# Altium project SCB.PrjPCB (part 8 of 8)

## Sheet CPU_EBI1_FPGA_Memory.SchDoc: CPU_EBI1_FPGA_Memory
size A3; Date: 18/06/2014; DrawnBy: J. Gabriel R.E.; Organization: Seven Solutions S.L.; Address1: C/Baza, Parcela 19, Nave 3; Address2: Polígono Ind. Juncaril; Address3: 18210-Peligros-Granada; Address4: Spain; Revision: 3.4; SheetNumber: 5; SheetTotal: 23; WebAddress: www.sevensols.com; Project: White Rabbit; ProjectName: Project Name
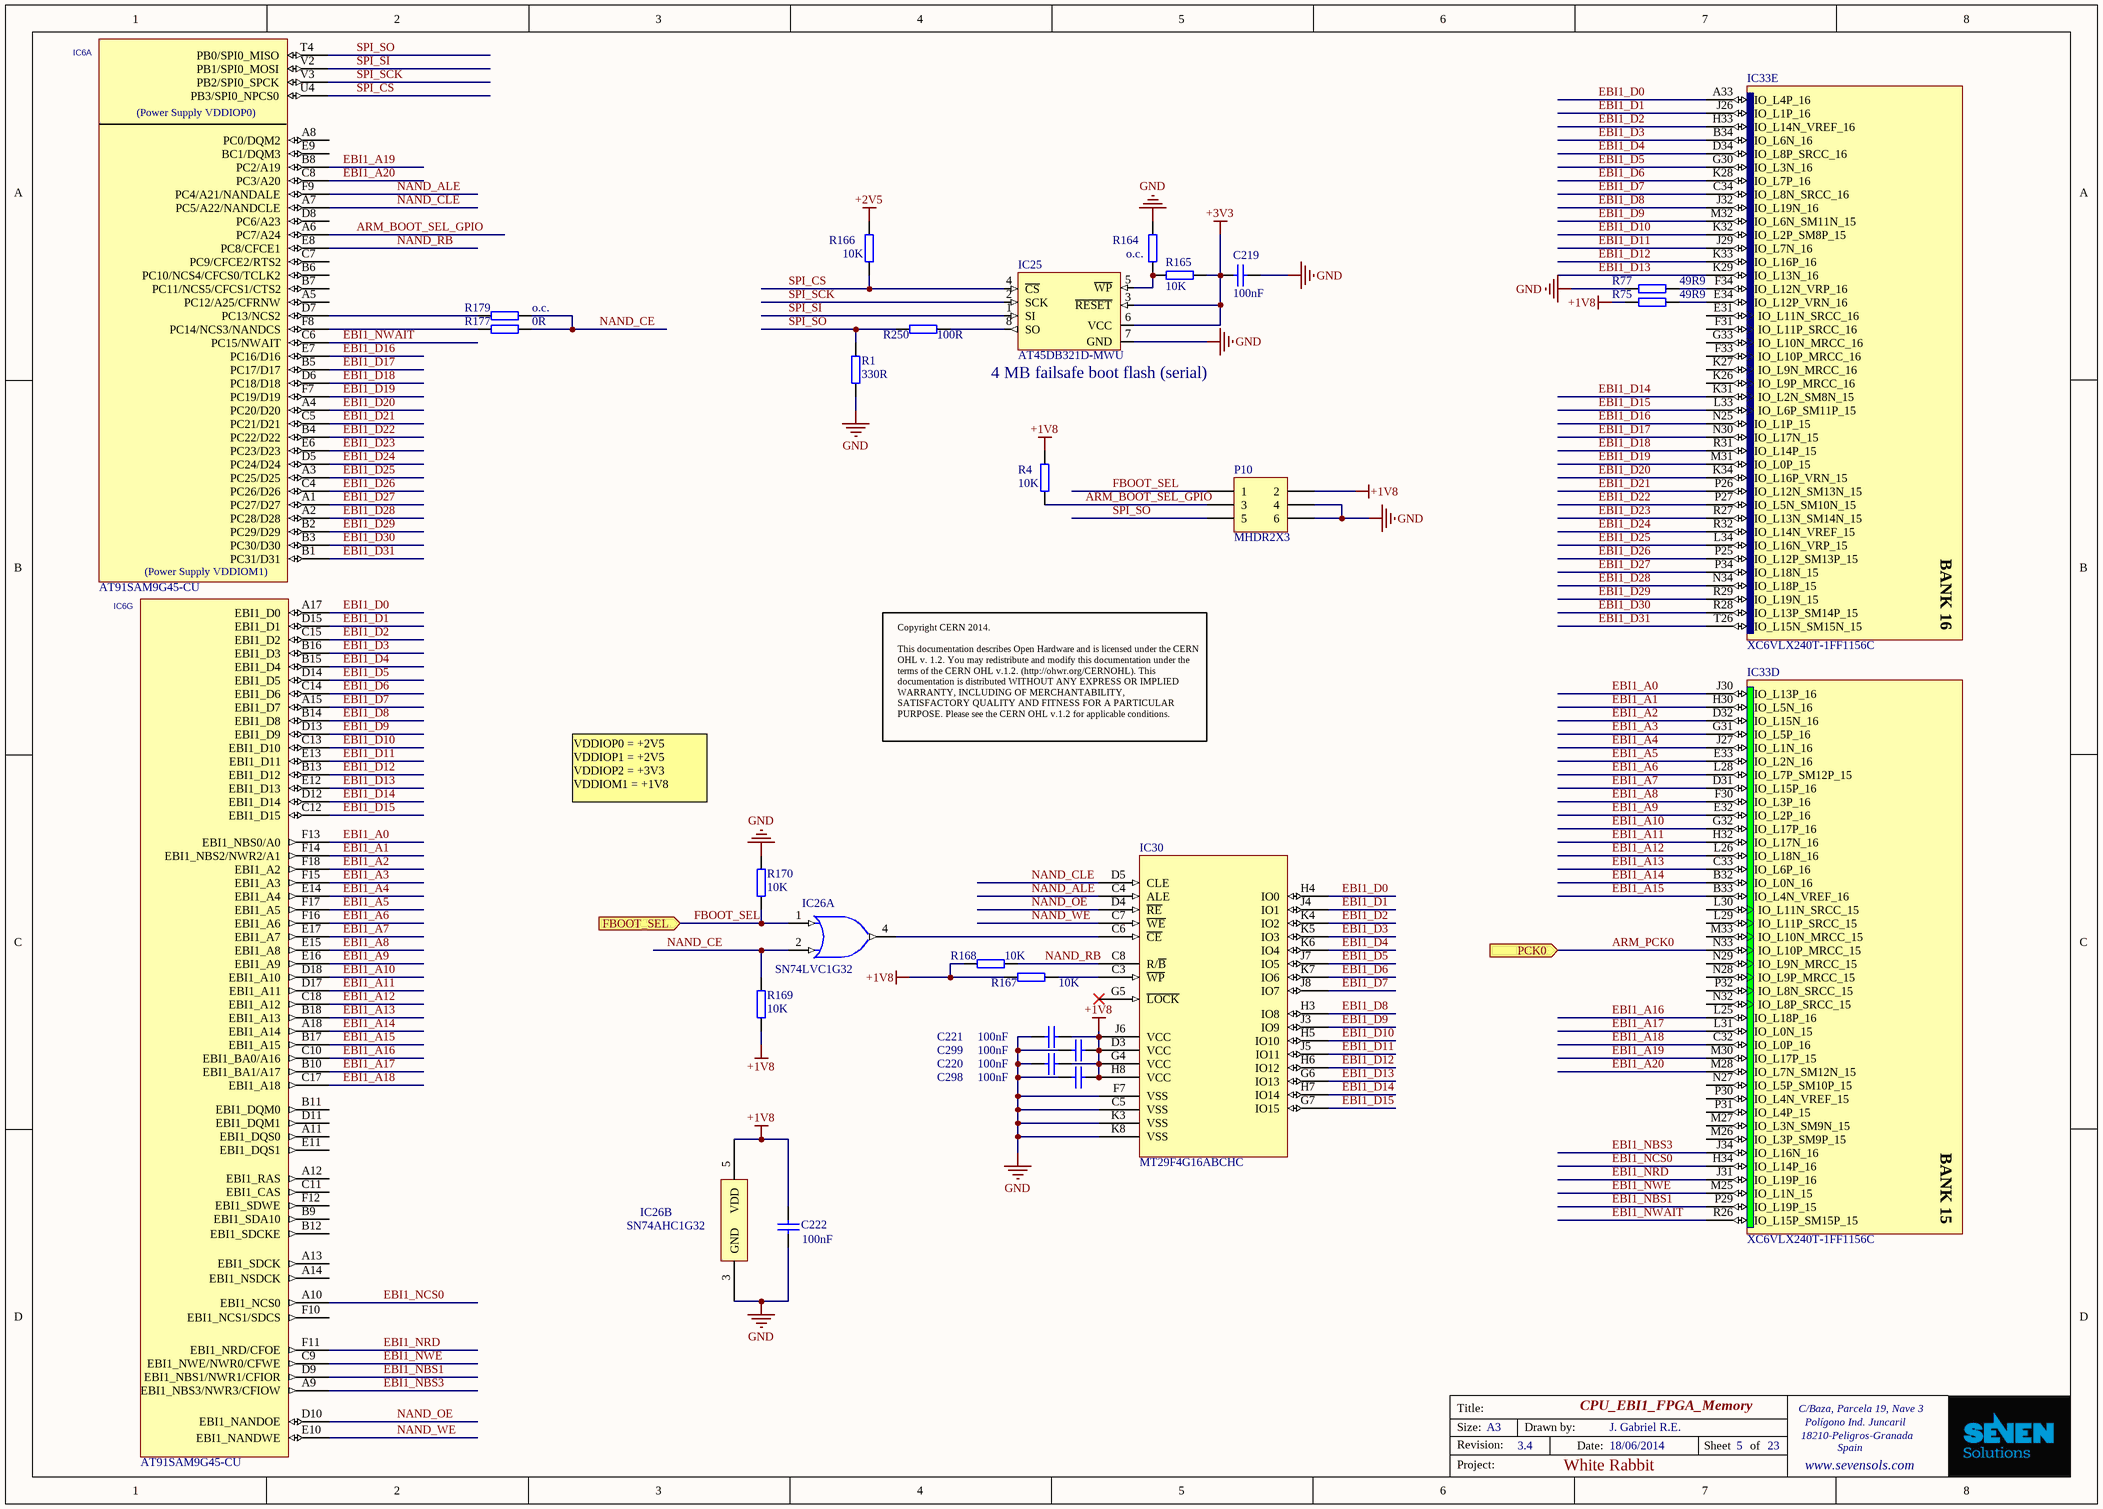
[diagram p22: CPU_EBI1_FPGA_Memory.SchDoc]

### Parts
C219  100nF  [CC1005-0402]
C220  100nF  [CC1005-0402]
C221  100nF  [CC1005-0402]
C222  100nF  [CC1005-0402]
C298  100nF  [CC1005-0402]
C299  100nF  [CC1005-0402]
IC6  AT91SAM9G45-CU  [TFBGA324]  (parts A,G of 12)
IC25  AT45DB321D-MWU  [8MW_8CN3_Merge]
IC26  SN74LVC1G32  [SOT23-5AL]  (parts A,B of 2)
IC30  MT29F4G16ABCHC  [VFBGA63]
IC33  XC6VLX240T-1FF1156C  [FF1156]  (parts D,E of 20)
P10  MHDR2X3  [MHDR2X3_1.27mm]
R1  330R  [0402]
R4  10K  [0402]
R75  49R9  [0402]
R77  49R9  [0402]
R164  o.c.  [0402]
R165  10K  [0402]
R166  10K  [0402]
R167  10K  [0402]
R168  10K  [0402]
R169  10K  [0402]
R170  10K  [0402]
R177  0R  [0603]
R179  o.c.  [0402]
R250  100R  [0402]

### Ports
FBOOT_SEL (in), PCK0 (in)

### Nets
+1V8: C220.1 C221.1 C222.2 C298.1 C299.1 IC26.5(VDD) IC30.D3(VCC) IC30.G4(VCC) IC30.H8(VCC) IC30.J6(VCC) P10.2 R4.2 R75.2 R167.2 R168.2 R169.2
+2V5: R166.2
+3V3: C219.1 IC25.3(~{RESET}) IC25.6(VCC) R165.2
GND: C219.2 C220.2 C221.2 C222.1 C298.2 C299.2 IC25.7(GND) IC26.3(GND) IC30.C5(VSS) IC30.F7(VSS) IC30.K3(VSS) IC30.K8(VSS) P10.4 P10.6 R1.1 R77.2 R164.1 R170.2
ARM_BOOT_SEL_GPIO: IC6.A6(PC7/A24) P10.3 R4.1
ARM_PCK0: IC33.N33(IO_L10P_MRCC_15) ; port PCK0
EBI1_A0: IC6.F13(EBI1_NBS0/A0) IC33.J30(IO_L13P_16)
EBI1_A1: IC6.F14(EBI1_NBS2/NWR2/A1) IC33.H30(IO_L5N_16)
EBI1_A2: IC6.F18(EBI1_A2) IC33.D32(IO_L15N_16)
EBI1_A3: IC6.F15(EBI1_A3) IC33.G31(IO_L5P_16)
EBI1_A4: IC6.E14(EBI1_A4) IC33.J27(IO_L1N_16)
EBI1_A5: IC6.F17(EBI1_A5) IC33.E33(IO_L2N_16)
EBI1_A6: IC6.F16(EBI1_A6) IC33.L28(IO_L7P_SM12P_15)
EBI1_A7: IC6.E17(EBI1_A7) IC33.D31(IO_L15P_16)
EBI1_A8: IC6.E15(EBI1_A8) IC33.F30(IO_L3P_16)
EBI1_A9: IC6.E16(EBI1_A9) IC33.E32(IO_L2P_16)
EBI1_A10: IC6.D18(EBI1_A10) IC33.G32(IO_L17P_16)
EBI1_A11: IC6.D17(EBI1_A11) IC33.H32(IO_L17N_16)
EBI1_A12: IC6.C18(EBI1_A12) IC33.L26(IO_L18N_16)
EBI1_A13: IC6.B18(EBI1_A13) IC33.C33(IO_L6P_16)
EBI1_A14: IC6.A18(EBI1_A14) IC33.B32(IO_L0N_16)
EBI1_A15: IC6.B17(EBI1_A15) IC33.B33(IO_L4N_VREF_16)
EBI1_A16: IC6.C10(EBI1_BA0/A16) IC33.L25(IO_L18P_16)
EBI1_A17: IC6.B10(EBI1_BA1/A17) IC33.L31(IO_L0N_15)
EBI1_A18: IC6.C17(EBI1_A18) IC33.C32(IO_L0P_16)
EBI1_A19: IC6.B8(PC2/A19) IC33.M30(IO_L17P_15)
EBI1_A20: IC6.C8(PC3/A20) IC33.M28(IO_L7N_SM12N_15)
EBI1_D0: IC6.A17(EBI1_D0) IC30.H4(IO0) IC33.A33(IO_L4P_16)
EBI1_D1: IC6.D15(EBI1_D1) IC30.J4(IO1) IC33.J26(IO_L1P_16)
EBI1_D2: IC6.C15(EBI1_D2) IC30.K4(IO2) IC33.H33(IO_L14N_VREF_16)
EBI1_D3: IC6.B16(EBI1_D3) IC30.K5(IO3) IC33.B34(IO_L6N_16)
EBI1_D4: IC6.B15(EBI1_D4) IC30.K6(IO4) IC33.D34(IO_L8P_SRCC_16)
EBI1_D5: IC6.D14(EBI1_D5) IC30.J7(IO5) IC33.G30(IO_L3N_16)
EBI1_D6: IC6.C14(EBI1_D6) IC30.K7(IO6) IC33.K28(IO_L7P_16)
EBI1_D7: IC6.A15(EBI1_D7) IC30.J8(IO7) IC33.C34(IO_L8N_SRCC_16)
EBI1_D8: IC6.B14(EBI1_D8) IC30.H3(IO8) IC33.J32(IO_L19N_16)
EBI1_D9: IC6.D13(EBI1_D9) IC30.J3(IO9) IC33.M32(IO_L6N_SM11N_15)
EBI1_D10: IC6.C13(EBI1_D10) IC30.H5(IO10) IC33.K32(IO_L2P_SM8P_15)
EBI1_D11: IC6.E13(EBI1_D11) IC30.J5(IO11) IC33.J29(IO_L7N_16)
EBI1_D12: IC6.B13(EBI1_D12) IC30.H6(IO12) IC33.K33(IO_L16P_16)
EBI1_D13: IC6.E12(EBI1_D13) IC30.G6(IO13) IC33.K29(IO_L13N_16)
EBI1_D14: IC6.D12(EBI1_D14) IC30.H7(IO14) IC33.K31(IO_L2N_SM8N_15)
EBI1_D15: IC6.C12(EBI1_D15) IC30.G7(IO15) IC33.L33(IO_L6P_SM11P_15)
EBI1_D16: IC6.E7(PC16/D16) IC33.N25(IO_L1P_15)
EBI1_D17: IC6.B5(PC17/D17) IC33.N30(IO_L17N_15)
EBI1_D18: IC6.D6(PC18/D18) IC33.R31(IO_L14P_15)
EBI1_D19: IC6.F7(PC19/D19) IC33.M31(IO_L0P_15)
EBI1_D20: IC6.A4(PC20/D20) IC33.K34(IO_L16P_VRN_15)
EBI1_D21: IC6.C5(PC21/D21) IC33.P26(IO_L12N_SM13N_15)
EBI1_D22: IC6.B4(PC22/D22) IC33.P27(IO_L5N_SM10N_15)
EBI1_D23: IC6.E6(PC23/D23) IC33.R27(IO_L13N_SM14N_15)
EBI1_D24: IC6.D5(PC24/D24) IC33.R32(IO_L14N_VREF_15)
EBI1_D25: IC6.A3(PC25/D25) IC33.L34(IO_L16N_VRP_15)
EBI1_D26: IC6.C4(PC26/D26) IC33.P25(IO_L12P_SM13P_15)
EBI1_D27: IC6.A1(PC27/D27) IC33.P34(IO_L18N_15)
EBI1_D28: IC6.A2(PC28/D28) IC33.N34(IO_L18P_15)
EBI1_D29: IC6.B2(PC29/D29) IC33.R29(IO_L19N_15)
EBI1_D30: IC6.B3(PC30/D30) IC33.R28(IO_L13P_SM14P_15)
EBI1_D31: IC6.B1(PC31/D31) IC33.T26(IO_L15N_SM15N_15)
EBI1_NBS1: IC6.D9(EBI1_NBS1/NWR1/CFIOR) IC33.P29(IO_L19P_15)
EBI1_NBS3: IC6.A9(EBI1_NBS3/NWR3/CFIOW) IC33.J34(IO_L16N_16)
EBI1_NCS0: IC6.A10(EBI1_NCS0) IC33.H34(IO_L14P_16)
EBI1_NRD: IC6.F11(EBI1_NRD/CFOE) IC33.J31(IO_L19P_16)
EBI1_NWAIT: IC6.C6(PC15/NWAIT) IC33.R26(IO_L15P_SM15P_15)
EBI1_NWE: IC6.C9(EBI1_NWE/NWR0/CFWE) IC33.M25(IO_L1N_15)
FBOOT_SEL: IC26.1(A) P10.1 R170.1 ; port FBOOT_SEL
NAND_ALE: IC6.F9(PC4/A21/NANDALE) IC30.C4(ALE)
NAND_CE: IC26.2(B) R169.1 R177.1 R179.1
NAND_CLE: IC6.A7(PC5/A22/NANDCLE) IC30.D5(CLE)
NAND_OE: IC6.D10(EBI1_NANDOE) IC30.D4(~{RE})
NAND_RB: IC6.E8(PC8/CFCE1) IC30.C8(R/~{B}) R168.1
NAND_WE: IC6.E10(EBI1_NANDWE) IC30.C7(~{WE})
SPI_CS: IC6.U4(PB3/SPI0_NPCS0) IC25.4(~{CS}) R166.1
SPI_SCK: IC6.V3(PB2/SPI0_SPCK) IC25.2(SCK)
SPI_SI: IC6.V2(PB1/SPI0_MOSI) IC25.1(SI)
SPI_SO: IC6.T4(PB0/SPI0_MISO) P10.5 R1.2 R250.2
NetIC6_D7: IC6.D7(PC13/NCS2) R179.2
NetIC6_F8: IC6.F8(PC14/NCS3/NANDCS) R177.2
NetIC25_5: IC25.5(~{WP}) R164.2 R165.1
NetIC25_8: IC25.8(SO) R250.1
NetIC26_4: IC26.4(Y) IC30.C6(~{CE})
NetIC30_C3: IC30.C3(~{WP}) R167.1
NetIC33_E34: IC33.E34(IO_L12P_VRN_16) R75.1
NetIC33_F34: IC33.F34(IO_L12N_VRP_16) R77.1

Not connected (* = marked no-connect by the designer): IC6 A5(PC12/A25/CFRNW) A8(PC0/DQM2) A11(EBI1_DQS0) A12(EBI1_RAS) A13(EBI1_SDCK) A14(EBI1_NSDCK) B6(PC10/NCS4/CFCS0/TCLK2) B7(PC11/NCS5/CFCS1/CTS2) B9(EBI1_SDA10) B11(EBI1_DQM0) B12(EBI1_SDCKE) C7(PC9/CFCE2/RTS2) C11(EBI1_CAS) D8(PC6/A23) D11(EBI1_DQM1) E9(BC1/DQM3) E11(EBI1_DQS1) F10(EBI1_NCS1/SDCS) F12(EBI1_SDWE); IC30 G5(~{LOCK})*; IC33 E31(IO_L11N_SRCC_16) F31(IO_L11P_SRCC_16) F33(IO_L10P_MRCC_16) G33(IO_L10N_MRCC_16) K26(IO_L9P_MRCC_16) K27(IO_L9N_MRCC_16) L29(IO_L11P_SRCC_15) L30(IO_L11N_SRCC_15) M26(IO_L3P_SM9P_15) M27(IO_L3N_SM9N_15) M33(IO_L10N_MRCC_15) N27(IO_L5P_SM10P_15) N28(IO_L9P_MRCC_15) N29(IO_L9N_MRCC_15) N32(IO_L8P_SRCC_15) P30(IO_L4N_VREF_15) P31(IO_L4P_15) P32(IO_L8N_SRCC_15)

### Notes on the sheet
- (near IC25) 4 MB failsafe boot flash (serial)
- Copyright CERN 2014.
  This documentation describes Open Hardware and is licensed under the CERN OHL v. 1.2. You may redistribute and modify this documentation under the terms of the CERN OHL v.1.2. (http://ohwr.org/CERNOHL). This documentation is distributed WITHOUT ANY EXPRESS OR IMPLIED WARRANTY, INCLUDING OF MERCHANTABILITY, SATISFACTORY QUALITY AND FITNESS FOR A PARTICULAR PURPOSE. Please see the CERN OHL v.1.2 for applicable conditions.
- VDDIOP0 = +2V5
  VDDIOP1 = +2V5
  VDDIOP2 = +3V3
  VDDIOM1 = +1V8
- Title:
- Size:
- Revision:
- A3
- Drawn by:
- Date:
- Sheet
- of
- Project:
- (in symbol AT91SAM9G45-CU, part A) (Power Supply VDDIOP0); (Power Supply VDDIOM1)
- (in symbol XC6VLX130T-1FF1156C, part D) BANK 15
- (in symbol XC6VLX130T-1FF1156C, part E) BANK 16

### Library data of the parts
C219-C222 C298 C299 = CC0402_100NF_16V_10%_X7R: Capacitor; Manufacturer1: TDK; Manufacturer1 PN: C1005X7R1C104K; TC: X7R; Tolerance: ±10%; Voltage: 16V; Published: 8-Jun-2000; LatestRevisionDate: 17-Jul-2002; LatestRevisionNote: Re-released for DXP Platform.; PackageReference: RAD-0.3; Publisher: Altium Limited; Distributor1: Digikey; Distributor1 PN: 445-4952-1-ND; Case: 0402; Value: 100nF
IC6 = AT91SAM9G45-CU: Atmel 400MHz ARM926 MCU; Value: AT91SAM9G45-CU; Distributor1 PN: AT91SAM9G45-CU-ND; Distributor1: Digikey
IC25 = AT45DB642D: 64-megabit 2.7V, Dual-Interface DataFlash; Value: AT45DB321D-MWU; Distributor1 PN: 556-AT45DB321D-MWU; Case: VDFN; Distributor1: Mouser
IC26 = SN74AHC1G32: TI single OR gate; RefId: 296-9847-1-ND; Value: SN74LVC1G32DBVR; Supplier: Digikey
IC30 = MT29F4G16ABCHC: NAND Flash 256Mx16, 1.8V Asynch/Page; Value: MT29F4G16ABCHC:C TR; Distributor1: Digikey; Distributor1 PN: 557-1369-1-ND
IC33 = XC6VLX130T-1FF1156C: Virtex-6 LXT Platform FPGA, 600 User I/Os, 20 GTXs, 1156-Ball FFBGA, Speed Grade 1, Commercial Grade; FirstPublished: 17-Nov-2009; DatasheetVersion: v2.0, Sep-2009; PackageVersion: ver1.0, Jun-2009; PackageReference: FF1156; Publisher: Altium Limited; PackageDescription: 1156-Ball Flip-Chip Fine Pitch Ball Grid Array (FF1156); Code_JEDEC: MS-034-AAR-1; Code_IPC: BGA100P34X34-1156; ComponentLink1Description: Virtex-6 Datasheet; ComponentLink1URL: http://www.xilinx.com/support/documentation/data_sheets/ds150.pdf; ComponentLink2Description: Pinout Specification; ComponentLink2URL: http://www.xilinx.com/support/packagefiles/virtex-6-pkgs.htm; ComponentLink3Description: FF1156 Package Drawing; ComponentLink3URL: http://www.xilinx.com/support/documentation/package_specs/ff1156.pdf; ComponentLink4Description: Virtex-6 Documents; ComponentLink4URL: http://www.xilinx.com/support/documentation/virtex-6.htm; ComponentLink5Description: Xilinx.com Home; ComponentLink5URL: http://www.xilinx.com
P10 = MHDR2X3: SMD Header, 3-Pin, Dual row, 2.54mm pitch; Manufacturer1 PN: GRPB032VWVN-RC; Manufacturer1: Sullins; Distributor1: Digikey; Distributor1 PN: S9015E-03-ND
R1 = R0402_330R_±1%_0.1W_100PPM: SMD Resistor; Manufacturer1: Panasonic; Manufacturer1 PN: ERJ-2RKF3300X; TCR: 100ppm; Power Rating: 0.1W; Tolerance: ±1%; Case: 0402; Distributor1: DigiKey; Distributor1 PN: P330LCT-ND; Value: 330R
R4 R165-R170 = R0402_10K_±1%_0.1W_100PPM: SMD Resistor; Manufacturer1: Panasonic; Manufacturer1 PN: ERJ-2RKF1002X; TCR: 100ppm; Power Rating: 0.1W; Tolerance: ±1%; Case: 0402; Distributor1: DigiKey; Distributor1 PN: P10.0KLCT-ND; Value: 10K
R75 R77 = R0402_49R9_±1%_0.1W_100PPM: SMD Resistor; Manufacturer1: Panasonic; Manufacturer1 PN: ERJ-2RKF49R9X; TCR: 100ppm; Power Rating: 0.1W; Tolerance: ±1%; Case: 0402; Distributor1: DigiKey; Distributor1 PN: P49.9LCT-ND; Value: 49R9
R164 R179 = R0402_O.C.: SMD Resistor; Mounted: No; Case: 0402; Manufacturer1: N/A; Manufacturer1 PN: N/A; Distributor1: N/A; Distributor1 PN: N/A; TCR: N/A; Power Rating: N/A; Tolerance: N/A; Value: o.c.
R177 = R0603_0R_0.1W_JUMPER: SMD Resistor; Manufacturer1: Yageo; Manufacturer1 PN: RC0603JR-070RL; TCR: 200ppm; Power Rating: 0.1W; Case: 0603; Distributor1: DigiKey; Distributor1 PN: 311-0.0GRCT-ND; Tolerance: -; Value: 0R
R250 = R0402_100R_±1%_0.1W_100PPM: SMD Resistor; Manufacturer1: Panasonic; Manufacturer1 PN: ERJ-2RKF1000X; TCR: 100ppm; Power Rating: 0.1W; Tolerance: ±1%; Case: 0402; Distributor1: DigiKey; Distributor1 PN: P100LCT-ND; Value: 100R

## Sheet CPU_DDR2.SchDoc: CPU_DDR2
size A4; Date: 18/06/2014; DrawnBy: J. Gabriel R.E.; Organization: Seven Solutions S.L.; Address1: C/Baza, Parcela 19, Nave 3; Address2: Polígono Ind. Juncaril; Address3: 18210-Peligros-Granada; Address4: Spain; Revision: 3.4; SheetNumber: 23; SheetTotal: 23; WebAddress: www.sevensols.com; Project: White Rabbit; ProjectName: White Rabbit
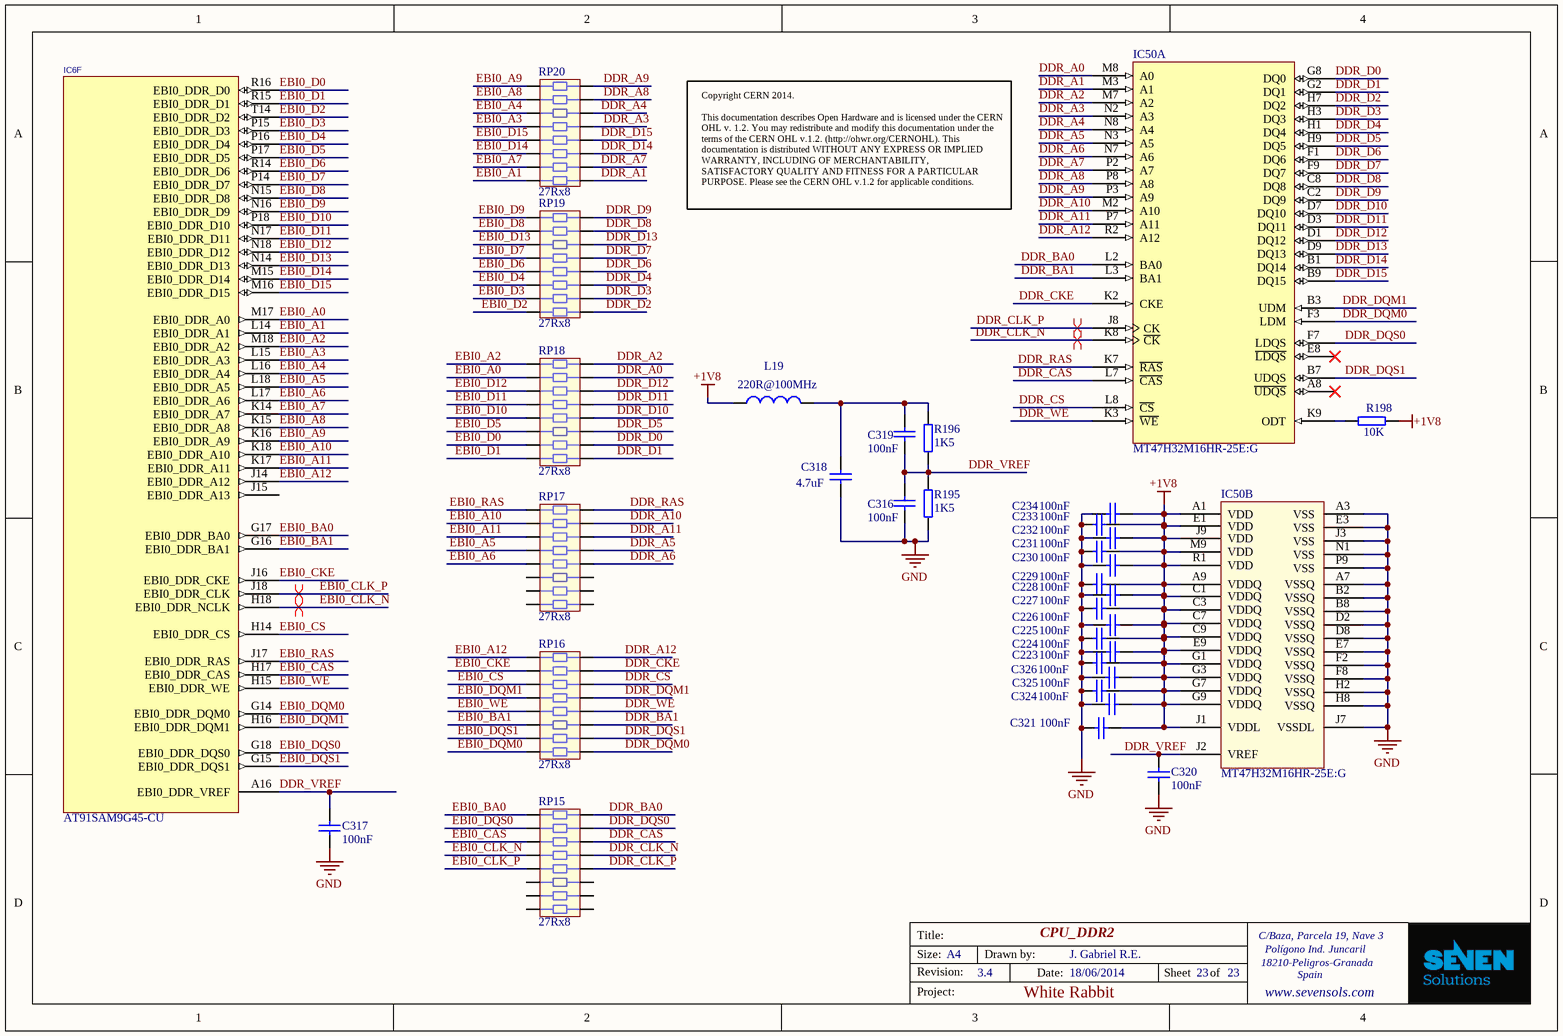
[diagram p23: CPU_DDR2.SchDoc]

### Parts
C223  100nF  [CC1005-0402]
C224  100nF  [CC1005-0402]
C225  100nF  [CC1005-0402]
C226  100nF  [CC1005-0402]
C227  100nF  [CC1005-0402]
C228  100nF  [CC1005-0402]
C229  100nF  [CC1005-0402]
C230  100nF  [CC1005-0402]
C231  100nF  [CC1005-0402]
C232  100nF  [CC1005-0402]
C233  100nF  [CC1005-0402]
C234  100nF  [CC1005-0402]
C316  100nF  [CC1005-0402]
C317  100nF  [CC1005-0402]
C318  4.7uF  [CC1608-0603]
C319  100nF  [CC1005-0402]
C320  100nF  [CC1005-0402]
C321  100nF  [CC1005-0402]
C324  100nF  [CC1005-0402]
C325  100nF  [CC1005-0402]
C326  100nF  [CC1005-0402]
IC6  AT91SAM9G45-CU  [TFBGA324]  (part F of 12)
IC50  MT47H32M16HR-25E:G  [BGA90C80P9X15_1250X800X120]  (parts A,B of 2)
L19  Impedance: 220R@100MHz  [0603]  (hidden comment: 220R@100MHz Ferrite Bead)
R195  1K5  [0402]
R196  1K5  [0402]
R198  10K  [0402]
RP15  value 27Rx8  [RESCAXS50P160X380X60-16N]  (hidden comment: 27R x 8)
RP16  value 27Rx8  [RESCAXS50P160X380X60-16N]  (hidden comment: 27R x 8)
RP17  value 27Rx8  [RESCAXS50P160X380X60-16N]  (hidden comment: 27R x 8)
RP18  value 27Rx8  [RESCAXS50P160X380X60-16N]  (hidden comment: 27R x 8)
RP19  value 27Rx8  [RESCAXS50P160X380X60-16N]  (hidden comment: 27R x 8)
RP20  value 27Rx8  [RESCAXS50P160X380X60-16N]  (hidden comment: 27R x 8)

### Nets
+1V8: C223.1 C224.1 C225.1 C226.1 C227.1 C228.1 C229.1 C230.1 C231.1 C232.1 C233.1 C234.1 C321.1 C324.1 C325.1 C326.1 IC50.A1(VDD) IC50.A9(VDDQ) IC50.C1(VDDQ) IC50.C3(VDDQ) IC50.C7(VDDQ) IC50.C9(VDDQ) IC50.E1(VDD) IC50.E9(VDDQ) IC50.G1(VDDQ) IC50.G3(VDDQ) IC50.G7(VDDQ) IC50.G9(VDDQ) IC50.J1(VDDL) IC50.J9(VDD) IC50.M9(VDD) IC50.R1(VDD) L19.1 R198.1
GND: C223.2 C224.2 C225.2 C226.2 C227.2 C228.2 C229.2 C230.2 C231.2 C232.2 C233.2 C234.2 C316.2 C317.2 C318.1 C320.2 C321.2 C324.2 C325.2 C326.2 IC50.A3(VSS) IC50.A7(VSSQ) IC50.B2(VSSQ) IC50.B8(VSSQ) IC50.D2(VSSQ) IC50.D8(VSSQ) IC50.E3(VSS) IC50.E7(VSSQ) IC50.F2(VSSQ) IC50.F8(VSSQ) IC50.H2(VSSQ) IC50.H8(VSSQ) IC50.J3(VSS) IC50.J7(VSSDL) IC50.N1(VSS) IC50.P9(VSS) R195.1
DDR_A0: IC50.M8(A0) RP18.15
DDR_A1: IC50.M3(A1) RP20.16
DDR_A2: IC50.M7(A2) RP18.16
DDR_A3: IC50.N2(A3) RP20.12
DDR_A4: IC50.N8(A4) RP20.11
DDR_A5: IC50.N3(A5) RP17.13
DDR_A6: IC50.N7(A6) RP17.12
DDR_A7: IC50.P2(A7) RP20.15
DDR_A8: IC50.P8(A8) RP20.10
DDR_A9: IC50.P3(A9) RP20.9
DDR_A10: IC50.M2(A10) RP17.15
DDR_A11: IC50.P7(A11) RP17.14
DDR_A12: IC50.R2(A12) RP16.16
DDR_BA0: IC50.L2(BA0) RP15.16
DDR_BA1: IC50.L3(BA1) RP16.11
DDR_CAS: IC50.L7(~{CAS}) RP15.14
DDR_CKE: IC50.K2(CKE) RP16.15
DDR_CLK_N: IC50.K8(~{CK}) RP15.13
DDR_CLK_P: IC50.J8(CK) RP15.12
DDR_CS: IC50.L8(~{CS}) RP16.14
DDR_D0: IC50.G8(DQ0) RP18.10
DDR_D1: IC50.G2(DQ1) RP18.9
DDR_D2: IC50.H7(DQ2) RP19.16
DDR_D3: IC50.H3(DQ3) RP19.15
DDR_D4: IC50.H1(DQ4) RP19.14
DDR_D5: IC50.H9(DQ5) RP18.11
DDR_D6: IC50.F1(DQ6) RP19.13
DDR_D7: IC50.F9(DQ7) RP19.12
DDR_D8: IC50.C8(DQ8) RP19.10
DDR_D9: IC50.C2(DQ9) RP19.9
DDR_D10: IC50.D7(DQ10) RP18.12
DDR_D11: IC50.D3(DQ11) RP18.13
DDR_D12: IC50.D1(DQ12) RP18.14
DDR_D13: IC50.D9(DQ13) RP19.11
DDR_D14: IC50.B1(DQ14) RP20.14
DDR_D15: IC50.B9(DQ15) RP20.13
DDR_DQM0: IC50.F3(LDM) RP16.9
DDR_DQM1: IC50.B3(UDM) RP16.13
DDR_DQS0: IC50.F7(LDQS) RP15.15
DDR_DQS1: IC50.B7(UDQS) RP16.10
DDR_RAS: IC50.K7(~{RAS}) RP17.16
DDR_VREF: C316.1 C317.1 C319.2 C320.1 IC6.A16(EBI0_DDR_VREF) IC50.J2(VREF) R195.2 R196.1
DDR_WE: IC50.K3(~{WE}) RP16.12
EBI0_A0: IC6.M17(EBI0_DDR_A0) RP18.2
EBI0_A1: IC6.L14(EBI0_DDR_A1) RP20.1
EBI0_A2: IC6.M18(EBI0_DDR_A2) RP18.1
EBI0_A3: IC6.L15(EBI0_DDR_A3) RP20.5
EBI0_A4: IC6.L16(EBI0_DDR_A4) RP20.6
EBI0_A5: IC6.L18(EBI0_DDR_A5) RP17.4
EBI0_A6: IC6.L17(EBI0_DDR_A6) RP17.5
EBI0_A7: IC6.K14(EBI0_DDR_A7) RP20.2
EBI0_A8: IC6.K15(EBI0_DDR_A8) RP20.7
EBI0_A9: IC6.K16(EBI0_DDR_A9) RP20.8
EBI0_A10: IC6.K18(EBI0_DDR_A10) RP17.2
EBI0_A11: IC6.K17(EBI0_DDR_A11) RP17.3
EBI0_A12: IC6.J14(EBI0_DDR_A12) RP16.1
EBI0_BA0: IC6.G17(EBI0_DDR_BA0) RP15.1
EBI0_BA1: IC6.G16(EBI0_DDR_BA1) RP16.6
EBI0_CAS: IC6.H17(EBI0_DDR_CAS) RP15.3
EBI0_CKE: IC6.J16(EBI0_DDR_CKE) RP16.2
EBI0_CLK_N: IC6.H18(EBI0_DDR_NCLK) RP15.4
EBI0_CLK_P: IC6.J18(EBI0_DDR_CLK) RP15.5
EBI0_CS: IC6.H14(EBI0_DDR_CS) RP16.3
EBI0_D0: IC6.R16(EBI0_DDR_D0) RP18.7
EBI0_D1: IC6.R15(EBI0_DDR_D1) RP18.8
EBI0_D2: IC6.T14(EBI0_DDR_D2) RP19.1
EBI0_D3: IC6.P15(EBI0_DDR_D3) RP19.2
EBI0_D4: IC6.P16(EBI0_DDR_D4) RP19.3
EBI0_D5: IC6.P17(EBI0_DDR_D5) RP18.6
EBI0_D6: IC6.R14(EBI0_DDR_D6) RP19.4
EBI0_D7: IC6.P14(EBI0_DDR_D7) RP19.5
EBI0_D8: IC6.N15(EBI0_DDR_D8) RP19.7
EBI0_D9: IC6.N16(EBI0_DDR_D9) RP19.8
EBI0_D10: IC6.P18(EBI0_DDR_D10) RP18.5
EBI0_D11: IC6.N17(EBI0_DDR_D11) RP18.4
EBI0_D12: IC6.N18(EBI0_DDR_D12) RP18.3
EBI0_D13: IC6.N14(EBI0_DDR_D13) RP19.6
EBI0_D14: IC6.M15(EBI0_DDR_D14) RP20.3
EBI0_D15: IC6.M16(EBI0_DDR_D15) RP20.4
EBI0_DQM0: IC6.G14(EBI0_DDR_DQM0) RP16.8
EBI0_DQM1: IC6.H16(EBI0_DDR_DQM1) RP16.4
EBI0_DQS0: IC6.G18(EBI0_DDR_DQS0) RP15.2
EBI0_DQS1: IC6.G15(EBI0_DDR_DQS1) RP16.7
EBI0_RAS: IC6.J17(EBI0_DDR_RAS) RP17.1
EBI0_WE: IC6.H15(EBI0_DDR_WE) RP16.5
NetC318_2: C318.2 C319.1 L19.2 R196.2
NetIC50_K9: IC50.K9(ODT) R198.2

Not connected (* = marked no-connect by the designer): IC6 J15(EBI0_DDR_A13); IC50 A8(~{UDQS})* E8(~{LDQS})*; RP15 6 7 8 9 10 11; RP17 6 7 8 9 10 11

### Layout directives
differential pair: DDR_CLK_N, DDR_CLK_P, EBI0_CLK_N, EBI0_CLK_P

### Notes on the sheet
- Copyright CERN 2014.
  This documentation describes Open Hardware and is licensed under the CERN OHL v. 1.2. You may redistribute and modify this documentation under the terms of the CERN OHL v.1.2. (http://ohwr.org/CERNOHL). This documentation is distributed WITHOUT ANY EXPRESS OR IMPLIED WARRANTY, INCLUDING OF MERCHANTABILITY, SATISFACTORY QUALITY AND FITNESS FOR A PARTICULAR PURPOSE. Please see the CERN OHL v.1.2 for applicable conditions.
- Title:
- Size:
- Revision:
- A4
- Drawn by:
- Date:
- Sheet
- of
- Project:

### Library data of the parts
C223-C234 C316 C317 C319-C321 C324-C326 = CC0402_100NF_16V_10%_X7R: as C219-C222 on sheet CPU_EBI1_FPGA_Memory; Published: 8-Jun-2000; LatestRevisionDate: 17-Jul-2002; LatestRevisionNote: Re-released for DXP Platform.; PackageReference: RAD-0.3; Publisher: Altium Limited; Distributor1: Digikey; Distributor1 PN: 445-4952-1-ND; Case: 0402; Value: 100nF
C318 = CC0603_4.7UF_10V_10%_X5R: Capacitor; Manufacturer1: TDK; Manufacturer1 PN: C1608X5R1A475K; TC: X5R; Tolerance: ±10%; Voltage: 10V; Published: 8-Jun-2000; LatestRevisionDate: 17-Jul-2002; LatestRevisionNote: Re-released for DXP Platform.; PackageReference: RAD-0.3; Publisher: Altium Limited; Distributor1: Digikey; Distributor1 PN: 445-5170-1-ND; Case: 0603; Value: 4.7uF
IC6 = AT91SAM9G45-CU: Atmel 400MHz ARM926 MCU; Value: AT91SAM9G45-CU; Distributor1 PN: AT91SAM9G45-CU-ND; Distributor1: Digikey
IC50 = MT47H32M16: DDR2 SDRAM 8Mx16x4 Banks; Value: MT47H32M16HR-25E:G; Distributor1 PN: MT47H32M16HR-25E:G-ND; Distributor1: Digikey
L19 = L_FERRITE_BEAD: ferrite bead; Manufacturer1: Murata; Manufacturer1 PN: BLM18KG221SN1D; Current Rating: 2.2A; DCR: 50mOhm; Case: 0603; Distributor1: Digikey; Distributor1 PN: 490-5255-1-ND
R195 R196 = R0402_1K5_±1%_0.1W_100PPM: SMD Resistor; Manufacturer1: Panasonic; Manufacturer1 PN: ERJ-2RKF1501X; TCR: 100ppm; Power Rating: 0.1W; Tolerance: ±1%; Case: 0402; Distributor1: DigiKey; Distributor1 PN: P1.50KLCT-ND; Value: 1K5
R198 = R0402_10K_±1%_0.1W_100PPM: as R4 on sheet CPU_EBI1_FPGA_Memory; Case: 0402; Distributor1: DigiKey; Distributor1 PN: P10.0KLCT-ND; Value: 10K
RP15-RP20 = RES_8xARRAY: 27R, 62.5mW Chip Resistor 8 Elements Array; Manufacturer1: Rohm; Manufacturer1 PN: MNR18E0APJ270; Tolerance: ±5%; TCR: 200ppm; Case: RESCAXS50P160X380X60-16N; Distributor1 PN: MNR18270CT-ND; Distributor1: DigiKey; Power Rating: 62.5mW

## Nets that join several sheets
+1V0: CPU_JTAG_Power_PLL (13 pins), Power_Supply (10 pins), FPGA_POWER_DGND (65 pins)
+1V0_GTX: FPGA_GTX (36 pins), FPGA_System_Monitor (R126.2), Power_Supply (C311.2 C312.2 IC39.8 R205.2)
+1V2_GTX: FPGA_GTX (39 pins), FPGA_System_Monitor (R117.2), Power_Supply (C246.2 C247.2 IC32.8 R180.2)
+1V5: FPGA_System_Monitor (R106.2), Power_Supply (13 pins)
+1V8: CPU_JTAG_Power_PLL (14 pins), External WatchDogs (C28.2 IC3.10 R16.2), FPGA_Configuration (C62.2 C63.2 IC36.A6 IC36.H3), FPGA_System_Monitor (R138.2), Power_Supply (9 pins), FPGA_POWER_DGND (37 pins), QDRII_mem (IC43.P6 IC43.R6), QDRII_power (54 pins), FPGA_QDRII (R97.2), CPU_EBI1_FPGA_Memory (16 pins), CPU_DDR2 (34 pins)
+2V5: Connectors (8 pins), CPU_JTAG_Power_PLL (13 pins), SCB_CLKs (C57.2 C58.2 IC11.5 R38.2), CPU_100M_Ethernet (7 pins), SMI_Link_7-12 (J3.29 J3.31), External WatchDogs (6 pins), FPGA_Configuration (22 pins), CPU_IO_Ports (R160.2 R161.2 R162.2 R163.2), FPGA_System_Monitor (R128.2 R129.2), Power_Supply (22 pins), FPGA_POWER_DGND (60 pins), QDRII_power (C417.1 IC45.7 IC45.10 R214.2), CPU_EBI1_FPGA_Memory (R166.2)
+2V5_PLL: SCB_PLLs (13 pins), Power_Supply (C263.2 C264.2 IC34.8 R188.1)
+3V0_OSC: SCB_CLKs (L2.2 L9.2 R145.2), Power_Supply (C235.2 IC38.5)
+3V0_VM53: SCB_CLKs (C33.1 C35.1 IC4.4 IC23.4), Power_Supply (C236.2 IC44.5)
+3V3: Connectors (CN2.1 CN2.3 CN2.5), CPU_JTAG_Power_PLL (7 pins), RS232_and_USB_ports (C242.1 C244.1 IC31.16), SCB_CLKs (11 pins), CPU_100M_Ethernet (L12.2), External WatchDogs (C27.2 IC2.10 R12.2), SCB_PLLs (11 pins), FPGA_System_Monitor (12 pins), Power_Supply (11 pins), CPU_EBI1_FPGA_Memory (C219.1 IC25.3 IC25.6 R165.2)
+3V3_PLL: SCB_PLLs (26 pins), Power_Supply (C266.2 C267.2 IC35.8 R189.1)
+5VCC_IN: Connectors (14 pins), FPGA_System_Monitor (R107.2), Power_Supply (37 pins)
GND: Connectors (63 pins), CPU_JTAG_Power_PLL (55 pins), RS232_and_USB_ports (8 pins), SCB_CLKs (54 pins), FPGA_GTX (41 pins), CPU_100M_Ethernet (R187.2 R192.2), SMI_Link_7-12 (J3.33 J3.34 J3.35 J3.36), uTCA_Tongue3 (58 pins), External WatchDogs (8 pins), FPGA_Configuration (17 pins), SCB_PLLs (76 pins), FPGA_System_Monitor (27 pins), Power_Supply (112 pins), FPGA_POWER_DGND (275 pins), QDRII_mem (IC43.R2), QDRII_power (81 pins), FPGA_QDRII (R96.2), FPGA_Peripherals_Control (R217.1), CPU_EBI1_FPGA_Memory (18 pins), CPU_DDR2 (37 pins)
GND_ETH: Connectors (CN1.9 CN1.12), CPU_100M_Ethernet (26 pins)
GND_SHIELD: Connectors (CN1.0), CPU_100M_Ethernet (C214.2 L10.1)
QDRII_VTT: QDRII_mem (14 pins), QDRII_power (21 pins)
VREFQDRII: QDRII_power (7 pins), FPGA_QDRII (IC33.AD19 IC33.AJ22 IC33.AK24 IC33.AK29)
+1V0_GTX_PG: Power_Supply (IC39.2 R207.2), FPGA_Peripherals_Control (IC33.AG15)
+1V2_GTX_PG: Power_Supply (IC32.2 R181.2), FPGA_Peripherals_Control (IC33.AJ14)
+2V5_PLL_PG: Power_Supply (IC34.2 R190.2), FPGA_Peripherals_Control (IC33.AK14)
+3V0_VM53_EN: Power_Supply (IC44.3 R211.1), FPGA_Peripherals_Control (IC33.AN15)
+3V3_PG: Power_Supply (IC48.2 R239.2), FPGA_Peripherals_Control (IC33.AJ15)
+3V3_PLL_PG: Power_Supply (IC35.2 R191.2), FPGA_Peripherals_Control (IC33.AF15)
ARM_DEBUG_RXD: Connectors (J1.96 P2.5), CPU_IO_Ports (IC6.P6)
ARM_DEBUG_TXD: Connectors (J1.94 P2.3), CPU_IO_Ports (IC6.R6)
ARM_FIQ: FPGA_Configuration (IC33.AC22 R52.2), CPU_IO_Ports (IC6.T9)
ARM_FPGA_RESET: FPGA_Configuration (IC33.M10), CPU_IO_Ports (IC6.M2)
ARM_IRQ: FPGA_Configuration (IC33.AC24 R53.2), CPU_IO_Ports (IC6.R9)
ARM_NRST: CPU_JTAG_Power_PLL (D6.1 D6.2), FPGA_Configuration (IC33.AD22 R51.2)
ARM_PCK0: CPU_IO_Ports (IC6.V1), CPU_EBI1_FPGA_Memory (IC33.N33)
ARM_PROGRAM_B: FPGA_Configuration (D10.2), CPU_IO_Ports (IC6.L6)
ARM_WD_RST: CPU_JTAG_Power_PLL (D5.1), External WatchDogs (IC2.4 S1.1)
AUX_CLK_N: FPGA_Configuration (IC33.B10), SCB_PLLs (R63.2)
AUX_CLK_P: FPGA_Configuration (IC33.A10), SCB_PLLs (R78.2)
CLK1_SEL: SCB_PLLs (IC12.12), FPGA_Peripherals_Control (IC33.AK17)
CLK10MHZ_EXT: SCB_CLKs (C67.2 R34.2), SCB_PLLs (C188.1), FPGA_System_Monitor (R251.1)
CLK_EN: SCB_PLLs (IC12.19 R248.1), FPGA_Peripherals_Control (IC33.AD16)
CPU_JTAG.JNRST: Connectors (P6.15), CPU_JTAG_Power_PLL (D5.3 D6.3 IC6.M10 R11.1)
CPU_JTAG.JNTRST: Connectors (P6.3), CPU_JTAG_Power_PLL (IC6.N10 R7.1)
CPU_JTAG.JRTCK: Connectors (P6.11), CPU_JTAG_Power_PLL (IC6.R11)
CPU_JTAG.JTCK: Connectors (P6.9), CPU_JTAG_Power_PLL (IC6.U10 R10.1)
CPU_JTAG.JTDI: Connectors (P6.5), CPU_JTAG_Power_PLL (IC6.R10 R8.1)
CPU_JTAG.JTDO: Connectors (P6.13), CPU_JTAG_Power_PLL (IC6.V10)
CPU_JTAG.JTMS: Connectors (P6.7), CPU_JTAG_Power_PLL (IC6.P10 R9.1)
CPU_SSC.RD1: Connectors (J2.23), CPU_IO_Ports (IC6.T8)
CPU_SSC.RF1: Connectors (J2.27), CPU_IO_Ports (IC6.M9)
CPU_SSC.RK1: Connectors (J2.25), CPU_IO_Ports (IC6.L9)
CPU_SSC.TD1: Connectors (J2.21), CPU_IO_Ports (IC6.U8)
CPU_SSC.TF1: Connectors (J2.17), CPU_IO_Ports (IC6.U9)
CPU_SSC.TK1: Connectors (J2.19), CPU_IO_Ports (IC6.V8)
DAC_CONTROL.DAC_DMTD_DIN: SCB_CLKs (IC8.7), FPGA_Peripherals_Control (IC33.AH17)
DAC_CONTROL.DAC_DMTD_SCLK: SCB_CLKs (IC8.6), FPGA_Peripherals_Control (IC33.AC15)
DAC_CONTROL.DAC_DMTD_SYNC: SCB_CLKs (IC8.5), FPGA_Peripherals_Control (IC33.AD17)
DAC_CONTROL.DAC_REF_DIN: SCB_CLKs (IC5.7), FPGA_Peripherals_Control (IC33.AP17)
DAC_CONTROL.DAC_REF_SCLK: SCB_CLKs (IC5.6), FPGA_Peripherals_Control (IC33.AN17)
DAC_CONTROL.DAC_REF_SYNC: SCB_CLKs (IC5.5), FPGA_Peripherals_Control (IC33.AM17)
DMTD_CLK_N: FPGA_Configuration (IC33.M22), SCB_PLLs (IC13.5)
DMTD_CLK_P: FPGA_Configuration (IC33.L23), SCB_PLLs (IC13.6)
DMTDCLK_mB_N: Connectors (J1.95), SCB_PLLs (IC13.2)
DMTDCLK_mB_P: Connectors (J1.93), SCB_PLLs (IC13.3)
ETH_100MHz.LED_ACT: Connectors (CN1.10), CPU_100M_Ethernet (IC41.3)
ETH_100MHz.LED_LINK: Connectors (CN1.11), CPU_100M_Ethernet (IC41.2 R199.2)
ETH_100MHz.RX_N: Connectors (CN1.6), CPU_100M_Ethernet (Tr1.9)
ETH_100MHz.RX_P: Connectors (CN1.3), CPU_100M_Ethernet (Tr1.11)
ETH_100MHz.TX_N: Connectors (CN1.2), CPU_100M_Ethernet (Tr1.14)
ETH_100MHz.TX_P: Connectors (CN1.1), CPU_100M_Ethernet (Tr1.16)
EXT_PROGRAM_B: Connectors (J1.85), FPGA_Configuration (D9.1)
EXTREFIN_10M_N: Connectors (P7.2), SCB_CLKs (R153.2 Tr2.4)
EXTREFIN_10M_P: Connectors (P7.1), SCB_CLKs (R152.2 Tr2.6)
FBOOT_SEL: Connectors (J2.29), CPU_EBI1_FPGA_Memory (IC26.1 P10.1 R170.1)
FPGA_25MHZ_CLK_N: SCB_CLKs (IC21.3), FPGA_Configuration (IC33.K23)
FPGA_25MHZ_CLK_P: SCB_CLKs (IC21.4), FPGA_Configuration (IC33.K24)
FPGA_CLK: FPGA_Configuration (IC33.K8 R43.2 R44.1), CPU_IO_Ports (IC6.R7)
FPGA_DIN: FPGA_Configuration (IC33.H8), CPU_IO_Ports (IC6.L8)
FPGA_DONE: Connectors (J1.87), FPGA_Configuration (Q1.3), CPU_IO_Ports (D13.2 IC6.L5)
FPGA_GCLK_N: Connectors (J1.91), FPGA_System_Monitor (IC33.E11)
FPGA_GCLK_P: Connectors (J1.89), FPGA_System_Monitor (IC33.D11)
FPGA_GPIO0: Connectors (J2.2), FPGA_GPIOs (IC33.AF34)
FPGA_GPIO1: Connectors (J2.4), FPGA_GPIOs (IC33.AE33)
FPGA_GPIO2: Connectors (J2.6), FPGA_GPIOs (IC33.AE34)
FPGA_GPIO3: Connectors (J2.8), FPGA_GPIOs (IC33.AD32)
FPGA_GPIO4: Connectors (J2.10), FPGA_GPIOs (IC33.AD34)
FPGA_GPIO5: Connectors (J2.12), FPGA_GPIOs (IC33.AC33)
FPGA_GPIO6: Connectors (J2.14), FPGA_GPIOs (IC33.AC34)
FPGA_GPIO7: Connectors (J2.16), FPGA_GPIOs (IC33.AB33)
FPGA_GPIO8: Connectors (J2.18), FPGA_GPIOs (IC33.AB32)
FPGA_GPIO9: Connectors (J2.20), FPGA_GPIOs (IC33.AA34)
FPGA_GPIO10: Connectors (J2.22), FPGA_GPIOs (IC33.AA33)
FPGA_GPIO11: Connectors (J2.24), FPGA_GPIOs (IC33.AA31)
FPGA_GPIO12: Connectors (J2.26), FPGA_GPIOs (IC33.AB30)
FPGA_GPIO13: Connectors (J2.28), FPGA_GPIOs (IC33.AC30)
FPGA_GPIO14: Connectors (J2.30), FPGA_GPIOs (IC33.AA28)
FPGA_GPIO15: Connectors (J2.32), FPGA_GPIOs (IC33.AA26)
FPGA_GPIO16: Connectors (J2.34), FPGA_GPIOs (IC33.AA25)
FPGA_GPIO17: Connectors (J2.36), FPGA_GPIOs (IC33.AB25)
FPGA_GPIO18: Connectors (J2.38), FPGA_GPIOs (IC33.AB27)
FPGA_GPIO19: Connectors (J2.40), FPGA_GPIOs (IC33.AC27)
FPGA_GPIO20: Connectors (J2.42), FPGA_GPIOs (IC33.AB28)
FPGA_GPIO21: Connectors (J2.44), FPGA_GPIOs (IC33.AD29)
FPGA_GPIO22: Connectors (J2.46), FPGA_GPIOs (IC33.AE31)
FPGA_GPIO23: Connectors (J2.48), FPGA_GPIOs (IC33.Y26)
FPGA_GPIO24: Connectors (J2.50), FPGA_GPIOs (IC33.AA29)
FPGA_GPIO25: Connectors (J2.52), FPGA_GPIOs (IC33.AA30)
FPGA_GPIO26: Connectors (J2.54), FPGA_GPIOs (IC33.AB31)
FPGA_GPIO27: Connectors (J2.56), FPGA_GPIOs (IC33.AC29)
FPGA_GPIO28: Connectors (J2.58), FPGA_GPIOs (IC33.AC32)
FPGA_GPIO29: Connectors (J2.60), FPGA_GPIOs (IC33.AD30)
FPGA_GPIO30: Connectors (J2.62), FPGA_GPIOs (IC33.AD31)
FPGA_GPIO31: Connectors (J2.64), FPGA_GPIOs (IC33.AE32)
FPGA_GPIO32: Connectors (J2.66), FPGA_GPIOs (IC33.AF33)
FPGA_GPIO33: Connectors (J2.68), FPGA_GPIOs (IC33.AC28)
FPGA_GPIO34: Connectors (J2.70), FPGA_GPIOs (IC33.AG33)
FPGA_GPIO35: Connectors (J2.72), FPGA_GPIOs (IC33.AB26)
FPGA_GPIO36: Connectors (J2.74), FPGA_GPIOs (IC33.AG32)
FPGA_GPIO37: Connectors (J2.76), FPGA_GPIOs (IC33.AF31)
FPGA_GPIO38: Connectors (J2.78), FPGA_GPIOs (IC33.AG31)
FPGA_GPIO39: Connectors (J2.80), FPGA_GPIOs (IC33.AC25)
FPGA_INIT_B: Connectors (J1.83), FPGA_Configuration (Q2.3), CPU_IO_Ports (D14.2 IC6.N1)
FPGA_JTAG.FPGA_TCK: Connectors (P5.6), FPGA_Configuration (IC33.AE8)
FPGA_JTAG.FPGA_TDI: Connectors (P5.10), FPGA_Configuration (IC33.AD8)
FPGA_JTAG.FPGA_TDO: Connectors (P5.8), FPGA_Configuration (IC33.AC8)
FPGA_JTAG.FPGA_TMS: Connectors (P5.4), FPGA_Configuration (IC33.AF8)
FPGA_RS232_RXD: RS232_and_USB_ports (IC31.9), FPGA_Peripherals_Control (R218.1)
FPGA_RS232_TXD: RS232_and_USB_ports (IC31.10), FPGA_Peripherals_Control (IC33.AJ17)
FPGA_USB_RX: Connectors (J1.92), FPGA_System_Monitor (IC33.D12)
FPGA_USB_TX: Connectors (J1.90), FPGA_System_Monitor (IC33.C12)
FPGA_WD.FPGA_WD_INT: External WatchDogs (IC3.8 R17.1), FPGA_Configuration (IC33.AC23)
FPGA_WD.FPGA_WD_PROGRAM: External WatchDogs (IC3.4 S2.2), FPGA_Configuration (D9.2)
FPGA_WD.FPGA_WD_SCL: External WatchDogs (IC3.7 R19.1), FPGA_Configuration (IC33.T24)
FPGA_WD.FPGA_WD_SDA: External WatchDogs (IC3.6 R18.1), FPGA_Configuration (IC33.T23)
MGTREFCLK.MGTREFCLK112_N: FPGA_GTX (IC33.AK5), SCB_PLLs (C138.1)
MGTREFCLK.MGTREFCLK112_P: FPGA_GTX (IC33.AK6), SCB_PLLs (C139.1)
MGTREFCLK.MGTREFCLK113_N: FPGA_GTX (IC33.AD5), SCB_PLLs (C122.1)
MGTREFCLK.MGTREFCLK113_P: FPGA_GTX (IC33.AD6), SCB_PLLs (C125.1)
MGTREFCLK.MGTREFCLK114_N: FPGA_GTX (IC33.V5), SCB_PLLs (C102.1)
MGTREFCLK.MGTREFCLK114_P: FPGA_GTX (IC33.V6), SCB_PLLs (C103.1)
MGTREFCLK.MGTREFCLK115_N: FPGA_GTX (IC33.P5), SCB_PLLs (C99.1)
MGTREFCLK.MGTREFCLK115_P: FPGA_GTX (IC33.P6), SCB_PLLs (C101.1)
MGTREFCLK.MGTREFCLK116_N: FPGA_GTX (IC33.H5), SCB_PLLs (C89.1)
MGTREFCLK.MGTREFCLK116_P: FPGA_GTX (IC33.H6), SCB_PLLs (C90.1)
MGTRX112_0_N: Connectors (J1.3), FPGA_GTX (IC33.AP6)
MGTRX112_0_P: Connectors (J1.1), FPGA_GTX (IC33.AP5)
MGTRX112_1_N: Connectors (J1.7), FPGA_GTX (IC33.AM6)
MGTRX112_1_P: Connectors (J1.5), FPGA_GTX (IC33.AM5)
MGTRX112_2_N: Connectors (J1.11), FPGA_GTX (IC33.AL4)
MGTRX112_2_P: Connectors (J1.9), FPGA_GTX (IC33.AL3)
MGTRX112_3_N: Connectors (J1.15), FPGA_GTX (IC33.AJ4)
MGTRX112_3_P: Connectors (J1.13), FPGA_GTX (IC33.AJ3)
MGTRX113_0_N: Connectors (J1.19), FPGA_GTX (IC33.AG4)
MGTRX113_0_P: Connectors (J1.17), FPGA_GTX (IC33.AG3)
MGTRX113_1_N: Connectors (J1.23), FPGA_GTX (IC33.AF6)
MGTRX113_1_P: Connectors (J1.21), FPGA_GTX (IC33.AF5)
MGTRX113_2_N: Connectors (J1.27), FPGA_GTX (IC33.AE4)
MGTRX113_2_P: Connectors (J1.25), FPGA_GTX (IC33.AE3)
MGTRX113_3_N: Connectors (J1.31), FPGA_GTX (IC33.AC4)
MGTRX113_3_P: Connectors (J1.29), FPGA_GTX (IC33.AC3)
MGTRX114_0_N: Connectors (J1.35), FPGA_GTX (IC33.AA4)
MGTRX114_0_P: Connectors (J1.33), FPGA_GTX (IC33.AA3)
MGTRX114_1_N: Connectors (J1.39), FPGA_GTX (IC33.W4)
MGTRX114_1_P: Connectors (J1.37), FPGA_GTX (IC33.W3)
MGTRX114_2_N: Connectors (J1.43), FPGA_GTX (IC33.U4)
MGTRX114_2_P: Connectors (J1.41), FPGA_GTX (IC33.U3)
MGTRX114_3_N: Connectors (J1.47), FPGA_GTX (IC33.R4)
MGTRX114_3_P: Connectors (J1.45), FPGA_GTX (IC33.R3)
MGTRX115_0_N: Connectors (J1.51), FPGA_GTX (IC33.N4)
MGTRX115_0_P: Connectors (J1.49), FPGA_GTX (IC33.N3)
MGTRX115_1_N: Connectors (J1.55), FPGA_GTX (IC33.L4)
MGTRX115_1_P: Connectors (J1.53), FPGA_GTX (IC33.L3)
MGTRX115_2_N: Connectors (J1.59), FPGA_GTX (IC33.K6)
MGTRX115_2_P: Connectors (J1.57), FPGA_GTX (IC33.K5)
MGTRX115_3_N: Connectors (J1.63), FPGA_GTX (IC33.J4)
MGTRX115_3_P: Connectors (J1.61), FPGA_GTX (IC33.J3)
MGTRX116_0_N: Connectors (J1.67), FPGA_GTX (IC33.G4)
MGTRX116_0_P: Connectors (J1.65), FPGA_GTX (IC33.G3)
MGTRX116_1_N: Connectors (J1.71), FPGA_GTX (IC33.E4)
MGTRX116_1_P: Connectors (J1.69), FPGA_GTX (IC33.E3)
MGTRX116_2_N: Connectors (J1.75), FPGA_GTX (IC33.D6)
MGTRX116_2_P: Connectors (J1.73), FPGA_GTX (IC33.D5)
MGTRX116_3_N: Connectors (J1.79), FPGA_GTX (IC33.B6)
MGTRX116_3_P: Connectors (J1.77), FPGA_GTX (IC33.B5)
MGTTX112_0_N: Connectors (J1.2), FPGA_GTX (IC33.AP2)
MGTTX112_0_P: Connectors (J1.4), FPGA_GTX (IC33.AP1)
MGTTX112_1_N: Connectors (J1.8), FPGA_GTX (IC33.AN4)
MGTTX112_1_P: Connectors (J1.6), FPGA_GTX (IC33.AN3)
MGTTX112_2_N: Connectors (J1.12), FPGA_GTX (IC33.AM2)
MGTTX112_2_P: Connectors (J1.10), FPGA_GTX (IC33.AM1)
MGTTX112_3_N: Connectors (J1.16), FPGA_GTX (IC33.AK2)
MGTTX112_3_P: Connectors (J1.14), FPGA_GTX (IC33.AK1)
MGTTX113_0_N: Connectors (J1.20), FPGA_GTX (IC33.AH2)
MGTTX113_0_P: Connectors (J1.18), FPGA_GTX (IC33.AH1)
MGTTX113_1_N: Connectors (J1.24), FPGA_GTX (IC33.AF2)
MGTTX113_1_P: Connectors (J1.22), FPGA_GTX (IC33.AF1)
MGTTX113_2_N: Connectors (J1.28), FPGA_GTX (IC33.AD2)
MGTTX113_2_P: Connectors (J1.26), FPGA_GTX (IC33.AD1)
MGTTX113_3_N: Connectors (J1.32), FPGA_GTX (IC33.AB2)
MGTTX113_3_P: Connectors (J1.30), FPGA_GTX (IC33.AB1)
MGTTX114_0_N: Connectors (J1.36), FPGA_GTX (IC33.Y2)
MGTTX114_0_P: Connectors (J1.34), FPGA_GTX (IC33.Y1)
MGTTX114_1_N: Connectors (J1.40), FPGA_GTX (IC33.V2)
MGTTX114_1_P: Connectors (J1.38), FPGA_GTX (IC33.V1)
MGTTX114_2_N: Connectors (J1.44), FPGA_GTX (IC33.T2)
MGTTX114_2_P: Connectors (J1.42), FPGA_GTX (IC33.T1)
MGTTX114_3_N: Connectors (J1.48), FPGA_GTX (IC33.P2)
MGTTX114_3_P: Connectors (J1.46), FPGA_GTX (IC33.P1)
MGTTX115_0_N: Connectors (J1.52), FPGA_GTX (IC33.M2)
MGTTX115_0_P: Connectors (J1.50), FPGA_GTX (IC33.M1)
MGTTX115_1_N: Connectors (J1.56), FPGA_GTX (IC33.K2)
MGTTX115_1_P: Connectors (J1.54), FPGA_GTX (IC33.K1)
MGTTX115_2_N: Connectors (J1.60), FPGA_GTX (IC33.H2)
MGTTX115_2_P: Connectors (J1.58), FPGA_GTX (IC33.H1)
MGTTX115_3_N: Connectors (J1.64), FPGA_GTX (IC33.F2)
MGTTX115_3_P: Connectors (J1.62), FPGA_GTX (IC33.F1)
MGTTX116_0_N: Connectors (J1.68), FPGA_GTX (IC33.D2)
MGTTX116_0_P: Connectors (J1.66), FPGA_GTX (IC33.D1)
MGTTX116_1_N: Connectors (J1.72), FPGA_GTX (IC33.C4)
MGTTX116_1_P: Connectors (J1.70), FPGA_GTX (IC33.C3)
MGTTX116_2_N: Connectors (J1.76), FPGA_GTX (IC33.B2)
MGTTX116_2_P: Connectors (J1.74), FPGA_GTX (IC33.B1)
MGTTX116_3_N: Connectors (J1.80), FPGA_GTX (IC33.A4)
MGTTX116_3_P: Connectors (J1.78), FPGA_GTX (IC33.A3)
miniBACKPLANE_CLK_N: Connectors (J1.84), SCB_PLLs (C158.1)
miniBACKPLANE_CLK_P: Connectors (J1.82), SCB_PLLs (C327.1)
NetC154_2: SCB_CLKs (IC7.4), SCB_PLLs (C154.2)
NetC185_1: SCB_CLKs (IC4.3 IC23.3), SCB_PLLs (C185.1)
NetD5_2: Connectors (J2.31), CPU_JTAG_Power_PLL (D5.2)
NetIC2_6: External WatchDogs (IC2.6 R14.1), CPU_IO_Ports (IC6.R2)
NetIC2_7: External WatchDogs (IC2.7 R15.1), CPU_IO_Ports (IC6.P4)
NetIC2_8: External WatchDogs (IC2.8 R13.1), CPU_IO_Ports (IC6.P13)
NetIC5_3: SCB_CLKs (IC5.3 IC5.4 R20.1), FPGA_System_Monitor (R139.2)
NetIC8_3: SCB_CLKs (IC8.3 IC8.4 R22.1), FPGA_System_Monitor (R127.2)
NetIC33_AL34: SCB_CLKs (Q3.1 R252.1), SMI_Link_7-12 (IC33.AL34)
NetIC33_J25: SCB_CLKs (R39.2 R40.2), FPGA_Configuration (IC33.J25)
NetP1_1: Connectors (P1.1), SCB_CLKs (R42.2 R257.2 R258.2)
NetP3_1: Connectors (P3.1), SCB_CLKs (R28.2)
NetP4_1: Connectors (P4.1), SCB_CLKs (R41.2)
PB0: Connectors (J2.57), CPU_IO_Ports (IC6.P12)
PB1: Connectors (J2.53), CPU_IO_Ports (IC6.T15)
PB2: Connectors (J2.55), CPU_IO_Ports (IC6.R12)
PB3: Connectors (J2.51), CPU_IO_Ports (IC6.T16)
PB4: Connectors (J2.59), CPU_IO_Ports (IC6.N12)
PB5: Connectors (J2.61), CPU_IO_Ports (IC6.M12)
PB6: Connectors (J2.49), CPU_IO_Ports (IC6.U14)
PB7: Connectors (J2.63), CPU_IO_Ports (IC6.M13)
PE0: Connectors (J2.69), CPU_IO_Ports (IC6.G4)
PE1: Connectors (J2.75), CPU_IO_Ports (IC6.F4)
PE2: Connectors (J2.73), CPU_IO_Ports (IC6.G5)
PE3: Connectors (J2.45), CPU_IO_Ports (IC6.F5)
PE4: Connectors (J2.43), CPU_IO_Ports (IC6.G7)
PE5: Connectors (J2.67), CPU_IO_Ports (IC6.H5)
PE6: Connectors (J2.71), CPU_IO_Ports (IC6.G3)
PE7: Connectors (J2.77), CPU_IO_Ports (IC6.H6)
PE8: Connectors (J2.41), CPU_IO_Ports (IC6.G6)
PE9: Connectors (J2.79), CPU_IO_Ports (IC6.H7)
PE10: Connectors (J2.33), CPU_IO_Ports (IC6.H8)
PE11: Connectors (J2.47), CPU_IO_Ports (IC6.G8)
PE12: Connectors (J2.35), CPU_IO_Ports (IC6.J5)
PE13: Connectors (J2.39), CPU_IO_Ports (IC6.H4)
PE14: Connectors (J2.37), CPU_IO_Ports (IC6.J3)
PE15: Connectors (J2.65), CPU_IO_Ports (IC6.J4)
PLL_CLK_OUT: Connectors (P8.1), SCB_PLLs (R65.1 Tr3.1)
PLL_CLKS.REF_CLK_N: FPGA_Configuration (IC33.H9), SCB_PLLs (IC16.47)
PLL_CLKS.REF_CLK_P: FPGA_Configuration (IC33.J9), SCB_PLLs (IC16.48)
PLL_CONTROL.PLL_CS: SCB_PLLs (IC16.17), FPGA_Peripherals_Control (IC33.AK18)
PLL_CONTROL.PLL_LOCK: SCB_PLLs (R219.2 R220.2), FPGA_Peripherals_Control (IC33.AF18)
PLL_CONTROL.PLL_REFSEL: SCB_PLLs (IC16.7), FPGA_Peripherals_Control (IC33.AK16)
PLL_CONTROL.PLL_RESET: SCB_PLLs (IC16.23 IC16.24 R249.2), FPGA_Peripherals_Control (IC33.AL16)
PLL_CONTROL.PLL_SCLK: SCB_PLLs (IC16.16), FPGA_Peripherals_Control (IC33.AE16)
PLL_CONTROL.PLL_SDI: SCB_PLLs (R222.2 R224.2), FPGA_Peripherals_Control (IC33.AH19)
PLL_CONTROL.PLL_SDO: SCB_PLLs (R221.2 R223.2), FPGA_Peripherals_Control (IC33.AJ19)
PLL_CONTROL.PLL_STAT: SCB_PLLs (R225.2 R226.2), FPGA_Peripherals_Control (IC33.AD15)
PLL_CONTROL.PLL_SYNC: SCB_PLLs (IC16.8), FPGA_Peripherals_Control (IC33.AG18)
PPS_OUT: SCB_CLKs (IC1.5 IC1.9 IC1.12), FPGA_Configuration (IC33.U23)
Q2_A0: QDRII_mem (IC43.B4 RP6.8), FPGA_QDRII (IC33.AM30)
Q2_A1: QDRII_mem (IC43.B8 RP6.10), FPGA_QDRII (IC33.AK28)
Q2_A2: QDRII_mem (IC43.C5 RP6.9), FPGA_QDRII (IC33.AN30)
Q2_A3: QDRII_mem (IC43.C6 RP12.7), FPGA_QDRII (IC33.AP31)
Q2_A4: QDRII_mem (IC43.C7 RP12.9), FPGA_QDRII (IC33.AJ27)
Q2_A5: QDRII_mem (IC43.N5 RP4.8), FPGA_QDRII (IC33.AM27)
Q2_A6: QDRII_mem (IC43.N6 RP4.9), FPGA_QDRII (IC33.AN28)
Q2_A7: QDRII_mem (IC43.N7 RP4.10), FPGA_QDRII (IC33.AM28)
Q2_A8: QDRII_mem (IC43.P4 RP2.5), FPGA_QDRII (IC33.AM26)
Q2_A9: QDRII_mem (IC43.P5 RP2.8), FPGA_QDRII (IC33.AJ25)
Q2_A10: QDRII_mem (IC43.P7 RP4.2), FPGA_QDRII (IC33.AN29)
Q2_A11: QDRII_mem (IC43.P8 RP4.3), FPGA_QDRII (IC33.AL28)
Q2_A12: QDRII_mem (IC43.R3 RP2.2), FPGA_QDRII (IC33.AH25)
Q2_A13: QDRII_mem (IC43.R4 RP2.4), FPGA_QDRII (IC33.AG26)
Q2_A14: QDRII_mem (IC43.R5 RP2.7), FPGA_QDRII (IC33.AG25)
Q2_A15: QDRII_mem (IC43.R7 RP2.9), FPGA_QDRII (IC33.AL26)
Q2_A16: QDRII_mem (IC43.R8 RP2.10), FPGA_QDRII (IC33.AP29)
Q2_A17: QDRII_mem (IC43.R9 RP4.4), FPGA_QDRII (IC33.AP30)
Q2_A18: QDRII_mem (IC43.A9 RP6.3), FPGA_QDRII (IC33.AH28)
Q2_BWS0: QDRII_mem (IC43.B7), FPGA_QDRII (IC33.AG13)
Q2_BWS1: QDRII_mem (IC43.A7), FPGA_QDRII (IC33.AM11)
Q2_BWS2: QDRII_mem (IC43.A5), FPGA_QDRII (IC33.AL13)
Q2_BWS3: QDRII_mem (IC43.B5), FPGA_QDRII (IC33.AC14)
Q2_CQ_N: QDRII_mem (IC43.A1), FPGA_QDRII (IC33.AK27)
Q2_CQ_P: QDRII_mem (IC43.A11), FPGA_QDRII (IC33.AN27)
Q2_D0: QDRII_mem (IC43.P10 RP4.5), FPGA_QDRII (IC33.AH10)
Q2_D1: QDRII_mem (IC43.N11 RP14.3), FPGA_QDRII (IC33.AK11)
Q2_D2: QDRII_mem (IC43.M11 RP14.5), FPGA_QDRII (IC33.AL11)
Q2_D3: QDRII_mem (IC43.K10 RP14.9), FPGA_QDRII (IC33.AP11)
Q2_D4: QDRII_mem (IC43.J11 RP14.10), FPGA_QDRII (IC33.AP12)
Q2_D5: QDRII_mem (IC43.G11 RP12.2), FPGA_QDRII (IC33.AM12)
Q2_D6: QDRII_mem (IC43.E10 RP12.5), FPGA_QDRII (IC33.AN14)
Q2_D7: QDRII_mem (IC43.D11 RP12.8), FPGA_QDRII (IC33.AP14)
Q2_D8: QDRII_mem (IC43.C11 RP6.5), FPGA_QDRII (IC33.AG11)
Q2_D9: QDRII_mem (IC43.N10 RP14.2), FPGA_QDRII (IC33.AM10)
Q2_D10: QDRII_mem (IC43.M9 RP14.4), FPGA_QDRII (IC33.AD11)
Q2_D11: QDRII_mem (IC43.L9 RP14.7), FPGA_QDRII (IC33.AE11)
Q2_D12: QDRII_mem (IC43.J9 RP14.8), FPGA_QDRII (IC33.AN12)
Q2_D13: QDRII_mem (IC43.G10 RP12.3), FPGA_QDRII (IC33.AN13)
Q2_D14: QDRII_mem (IC43.F9 RP12.4), FPGA_QDRII (IC33.AM13)
Q2_D15: QDRII_mem (IC43.D10 RP6.4), FPGA_QDRII (IC33.AK13)
Q2_D16: QDRII_mem (IC43.C9 RP12.10), FPGA_QDRII (IC33.AH12)
Q2_D17: QDRII_mem (IC43.B9 RP6.2), FPGA_QDRII (IC33.AF13)
Q2_D18: QDRII_mem (IC43.B3 RP6.7), FPGA_QDRII (IC33.AG12)
Q2_D19: QDRII_mem (IC43.C3 RP10.7), FPGA_QDRII (IC33.AH14)
Q2_D20: QDRII_mem (IC43.D2 RP10.9), FPGA_QDRII (IC33.AC13)
Q2_D21: QDRII_mem (IC43.F3 RP10.3), FPGA_QDRII (IC33.AC12)
Q2_D22: QDRII_mem (IC43.G2 RP10.5), FPGA_QDRII (IC33.AE14)
Q2_D23: QDRII_mem (IC43.J3 RP7.7), FPGA_QDRII (IC33.AF14)
Q2_D24: QDRII_mem (IC43.L3 RP7.10), FPGA_QDRII (IC33.AD12)
Q2_D25: QDRII_mem (IC43.M3 RP7.2), FPGA_QDRII (IC33.AE12)
Q2_D26: QDRII_mem (IC43.N2 RP7.4), FPGA_QDRII (IC33.AJ10)
Q2_D27: QDRII_mem (IC43.C1 RP10.8), FPGA_QDRII (IC33.AH13)
Q2_D28: QDRII_mem (IC43.D1 RP10.10), FPGA_QDRII (IC33.AJ12)
Q2_D29: QDRII_mem (IC43.E2 RP10.2), FPGA_QDRII (IC33.AD14)
Q2_D30: QDRII_mem (IC43.G1 RP10.4), FPGA_QDRII (IC33.AK12)
Q2_D31: QDRII_mem (IC43.J1 RP7.8), FPGA_QDRII (IC33.AF11)
Q2_D32: QDRII_mem (IC43.K2 RP7.9), FPGA_QDRII (IC33.AE13)
Q2_D33: QDRII_mem (IC43.M1 RP7.3), FPGA_QDRII (IC33.AL10)
Q2_D34: QDRII_mem (IC43.N1 RP7.5), FPGA_QDRII (IC33.AJ11)
Q2_D35: QDRII_mem (IC43.P2 RP2.3), FPGA_QDRII (IC33.AG10)
Q2_DOFF: QDRII_mem (IC43.H1), FPGA_QDRII (IC33.AK26)
Q2_K_N: QDRII_mem (IC43.A6), FPGA_QDRII (IC33.AH24)
Q2_K_P: QDRII_mem (IC43.B6), FPGA_QDRII (IC33.AH23)
Q2_Q0: QDRII_mem (IC43.P11), FPGA_QDRII (IC33.AE19)
Q2_Q1: QDRII_mem (IC43.M10), FPGA_QDRII (IC33.AK19)
Q2_Q2: QDRII_mem (IC43.L11), FPGA_QDRII (IC33.AN18)
Q2_Q3: QDRII_mem (IC43.K11), FPGA_QDRII (IC33.AD20)
Q2_Q4: QDRII_mem (IC43.J10), FPGA_QDRII (IC33.AK21)
Q2_Q5: QDRII_mem (IC43.F11), FPGA_QDRII (IC33.AK22)
Q2_Q6: QDRII_mem (IC43.E11), FPGA_QDRII (IC33.AP27)
Q2_Q7: QDRII_mem (IC43.C10), FPGA_QDRII (IC33.AG22)
Q2_Q8: QDRII_mem (IC43.B11), FPGA_QDRII (IC33.AD21)
Q2_Q9: QDRII_mem (IC43.P9), FPGA_QDRII (IC33.AC19)
Q2_Q10: QDRII_mem (IC43.N9), FPGA_QDRII (IC33.AF19)
Q2_Q11: QDRII_mem (IC43.L10), FPGA_QDRII (IC33.AL18)
Q2_Q12: QDRII_mem (IC43.K9), FPGA_QDRII (IC33.AF20)
Q2_Q13: QDRII_mem (IC43.G9), FPGA_QDRII (IC33.AL23)
Q2_Q14: QDRII_mem (IC43.F10), FPGA_QDRII (IC33.AP24)
Q2_Q15: QDRII_mem (IC43.E9), FPGA_QDRII (IC33.AL25)
Q2_Q16: QDRII_mem (IC43.D9), FPGA_QDRII (IC33.AH22)
Q2_Q17: QDRII_mem (IC43.B10), FPGA_QDRII (IC33.AC20)
Q2_Q18: QDRII_mem (IC43.B2), FPGA_QDRII (IC33.AE21)
Q2_Q19: QDRII_mem (IC43.D3), FPGA_QDRII (IC33.AP26)
Q2_Q20: QDRII_mem (IC43.E3), FPGA_QDRII (IC33.AM25)
Q2_Q21: QDRII_mem (IC43.F2), FPGA_QDRII (IC33.AL24)
Q2_Q22: QDRII_mem (IC43.G3), FPGA_QDRII (IC33.AM23)
Q2_Q23: QDRII_mem (IC43.K3), FPGA_QDRII (IC33.AM20)
Q2_Q24: QDRII_mem (IC43.L2), FPGA_QDRII (IC33.AN20)
Q2_Q25: QDRII_mem (IC43.N3), FPGA_QDRII (IC33.AN19)
Q2_Q26: QDRII_mem (IC43.P3), FPGA_QDRII (IC33.AM18)
Q2_Q27: QDRII_mem (IC43.B1), FPGA_QDRII (IC33.AN25)
Q2_Q28: QDRII_mem (IC43.C2), FPGA_QDRII (IC33.AP25)
Q2_Q29: QDRII_mem (IC43.E1), FPGA_QDRII (IC33.AN24)
Q2_Q30: QDRII_mem (IC43.F1), FPGA_QDRII (IC33.AK23)
Q2_Q31: QDRII_mem (IC43.J2), FPGA_QDRII (IC33.AL20)
Q2_Q32: QDRII_mem (IC43.K1), FPGA_QDRII (IC33.AP21)
Q2_Q33: QDRII_mem (IC43.L1), FPGA_QDRII (IC33.AL19)
Q2_Q34: QDRII_mem (IC43.M2), FPGA_QDRII (IC33.AP20)
Q2_Q35: QDRII_mem (IC43.P1), FPGA_QDRII (IC33.AP19)
Q2_RPS: QDRII_mem (IC43.A8), FPGA_QDRII (IC33.AH27)
Q2_WPS: QDRII_mem (IC43.A4), FPGA_QDRII (IC33.AL29)
QDR2_VTT_GOOD: QDRII_power (IC45.9 R214.1), FPGA_Peripherals_Control (IC33.AM15)
RS232_FPGA_RXD: Connectors (P2.6), RS232_and_USB_ports (IC31.8)
RS232_FPGA_TXD: Connectors (P2.4), RS232_and_USB_ports (IC31.7)
RS232_MNG.RS232_MNG_RXD: Connectors (J2.3), RS232_and_USB_ports (IC31.13)
RS232_MNG.RS232_MNG_TXD: Connectors (J2.1), RS232_and_USB_ports (IC31.14)
SERDES_CLK_N: SCB_PLLs (R30.2), FPGA_Peripherals_Control (IC33.G20)
SERDES_CLK_P: SCB_PLLs (R70.2), FPGA_Peripherals_Control (IC33.F21)
SPI1.SPI1_MISO: CPU_IO_Ports (IC6.M7), FPGA_Peripherals_Control (IC33.AL14)
SPI1.SPI1_MOSI: CPU_IO_Ports (IC6.V5), FPGA_Peripherals_Control (IC33.AL15)
SPI1.SPI1_NPCS0: CPU_IO_Ports (IC6.U6), FPGA_Peripherals_Control (IC33.AG16)
SPI1.SPI1_SPCK: CPU_IO_Ports (IC6.T6), FPGA_Peripherals_Control (IC33.AC18)
SYNC_CLK_N: SCB_CLKs (R25.1 U1.4), SCB_PLLs (IC16.25)
SYNC_CLK_P: SCB_CLKs (R24.1 U1.3), SCB_PLLs (IC16.26)
SYNC_DATA_N: SCB_CLKs (R29.1 U1.1), FPGA_Peripherals_Control (R95.2 R141.2 R148.1)
SYNC_DATA_P: SCB_CLKs (R29.2 U1.2), FPGA_Peripherals_Control (R140.2 R141.1 R148.2)
USB_5VBus: Connectors (J2.7), RS232_and_USB_ports (C315.1 R176.1)
USB_DDP_N: Connectors (J2.9), RS232_and_USB_ports (IC6.U16 R172.2)
USB_DDP_P: Connectors (J2.11), RS232_and_USB_ports (IC6.U15 R173.2)
USB_HDP_N: Connectors (J2.13), RS232_and_USB_ports (IC6.R17 R182.2)
USB_HDP_P: Connectors (J2.15), RS232_and_USB_ports (IC6.T17 R183.2)
uTCA_CLK.uTCA_TONGUE2_CLK1_N: Connectors (CN2.10), SCB_PLLs (C152.1)
uTCA_CLK.uTCA_TONGUE2_CLK1_P: Connectors (CN2.12), SCB_PLLs (C153.1)
uTCA_CLK.uTCA_TONGUE2_CLK2_N: Connectors (CN2.16), SCB_PLLs (C149.1)
uTCA_CLK.uTCA_TONGUE2_CLK2_P: Connectors (CN2.18), SCB_PLLs (C150.1)

## Assembly variants
standard: not fitted C27 C28 C32 C39 C62 C63 C64 C65 C66 C67 C188 C198 C200 C329 C330 C331 C332 C333 C334 C335 C336 C337 C338 C339 C340 C341 C342 C343 C344 C345 C346 C347 C348 C349 C350 C351 C352 C353 C354 C355 C356 C357 C358 C359 C360 C361 C362 C363 C364 C365 C366 C367 C368 C369 C370 C371 C372 C373 C374 C375 C376 C377 C378 C379 C380 C381 C382 C383 C384 C385 C386 C387 C388 C389 C390 C391 C392 C393 C394 C395 C396 C397 C398 C399 C400 C401 C402 C403 C404 C405 C406 C407 C408 C409 C410 C411 C412 C413 C414 C415 C416 C417 C418 C419 C420 C421 CN2 IC2 IC3 IC23 IC36 IC42 IC43 IC45 J3 J4 P9 R2 R3 R12 R13 R14 R15 R16 R17 R18 R19 R43 R44 R50 R51 R52 R53 R54 R56 R57 R58 R60 R61 R62 R63 R64 R65 R66 R67 R96 R97 R119 R122 R123 R125 R127 R131 R134 R135 R137 R139 R212 R213 R214 R215 R216 R227 R235 RP1 RP2 RP3 RP4 RP5 RP6 RP7 RP8 RP9 RP10 RP11 RP12 RP13 RP14 S3 Tr2 X3 X4